# EAGLE design Energy Monitor (EAGLE 7.1.0)
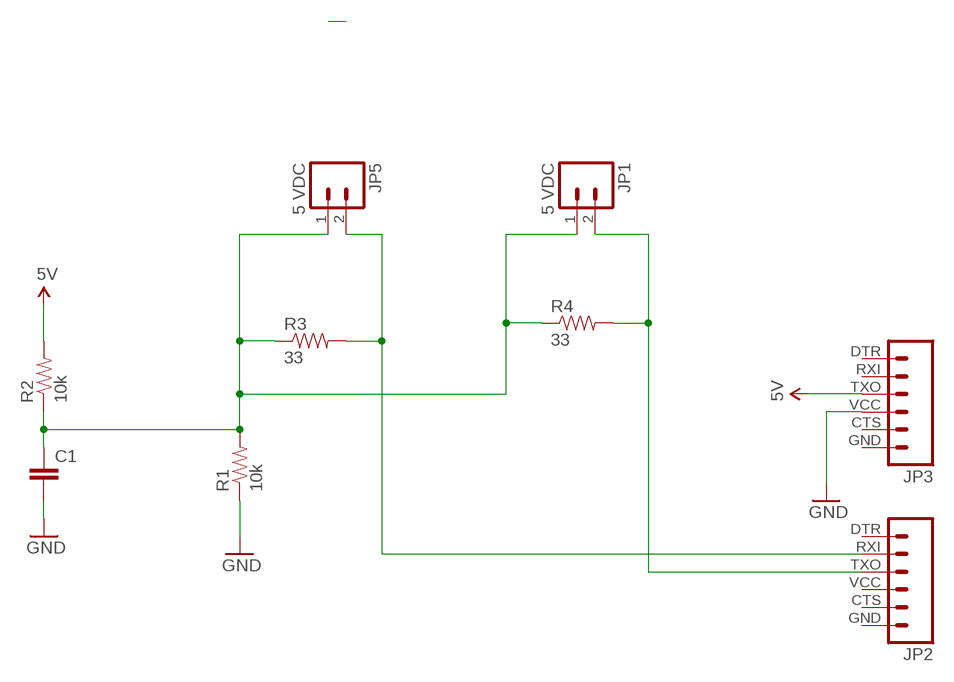
[diagram p0: schematic, sheet 1]

## Parts
C1  CAPPTH2  [CAP-PTH-SMALL2]
JP1  5 VDC  M025MM  [SCREWTERMINAL-5MM-2]
JP2  M06SIP  [1X06]
JP3  M06SIP  [1X06]
JP5  5 VDC  M025MM  [SCREWTERMINAL-5MM-2]
R1  10k  RESISTORAXIAL-0.3  [AXIAL-0.3]
R2  10k  RESISTORAXIAL-0.3  [AXIAL-0.3]
R3  33  RESISTORAXIAL-0.3  [AXIAL-0.3]
R4  33  RESISTORAXIAL-0.3  [AXIAL-0.3]

## Nets
5V: JP3.TXO R2.P$2
GND: C1.2 JP3.VCC R1.P$1
N$1: C1.1 JP1.1 JP5.1 R1.P$2 R2.P$1 R3.P$1 R4.P$1
N$3: JP1.2 JP2.TXO R4.P$2
N$5: JP2.RXI JP5.2 R3.P$2
Unconnected: JP2.CTS JP2.DTR JP2.GND JP2.VCC JP3.CTS JP3.DTR JP3.GND JP3.RXI

## Library data of the parts
C1 = SparkFun-Capacitors:CAP: Capacitor Standard 0603 ceramic capacitor, and 0.1" leaded capacitor.
JP1 JP5 = SparkFun-Connectors:M02: Standard 2-pin 0.1" header. Use with - straight break away headers ( PRT-00116) - right angle break away headers (PRT-00553) - swiss pins (PRT-00743) - machine pins (PRT-00117) - female headers (PRT-00115) Molex polarized connector foot print use with: PRT-08233 with associated crimp pins and housings. 2.54_SCREWTERM for use with PRT-10571. 3.5mm Screw Terminal footprints for PRT-08084 5mm Screw Terminal footprints for use with PRT-08432; STOREFRONT_ID: PRT-08432
JP2 JP3 = SparkFun-Connectors:M06: Header 6 Standard 6-pin 0.1" header. Use with straight break away headers (SKU : PRT-00116), right angle break away headers (PRT-00553), swiss pins (PRT-00743), machine pins (PRT-00117), and female headers (PRT-00115). Molex polarized connector foot print use with SKU : PRT-08094 with associated crimp pins and housings. NOTES ON THE VARIANTS LOCK and LOCK_LONGPADS... This footprint was designed to help hold the alignment of a through-hole component (i.e. 6-pin header) while soldering it into place. You may notice that each hole has been shifted either up or down by 0.005 of an inch from it's more standard position (which is a perfectly straight line). This slight alteration caused the pins (the squares in the middle) to touch the edges of the holes. Because they are alternating, it causes a "brace" to hold the component in place. 0.005 has proven to be the perfect amount of "off-center" position when using our standard breakaway headers. Although looks a little odd when you look at the bare footprint, once you have a header in there, the alteration is very hard to notice. Also,if you push a header all the way into place, it is covered up entirely on the bottom side. This idea of altering the position of holes to aid alignment will be further integrated into the Sparkfun Library for other footprints. It can help hold any component with 3 or more connection pins.
R1-R4 = SparkFun-Resistors:RESISTOR: Resistor Basic schematic elements and footprints for 0603, 1206, and PTH resistors.

## Board
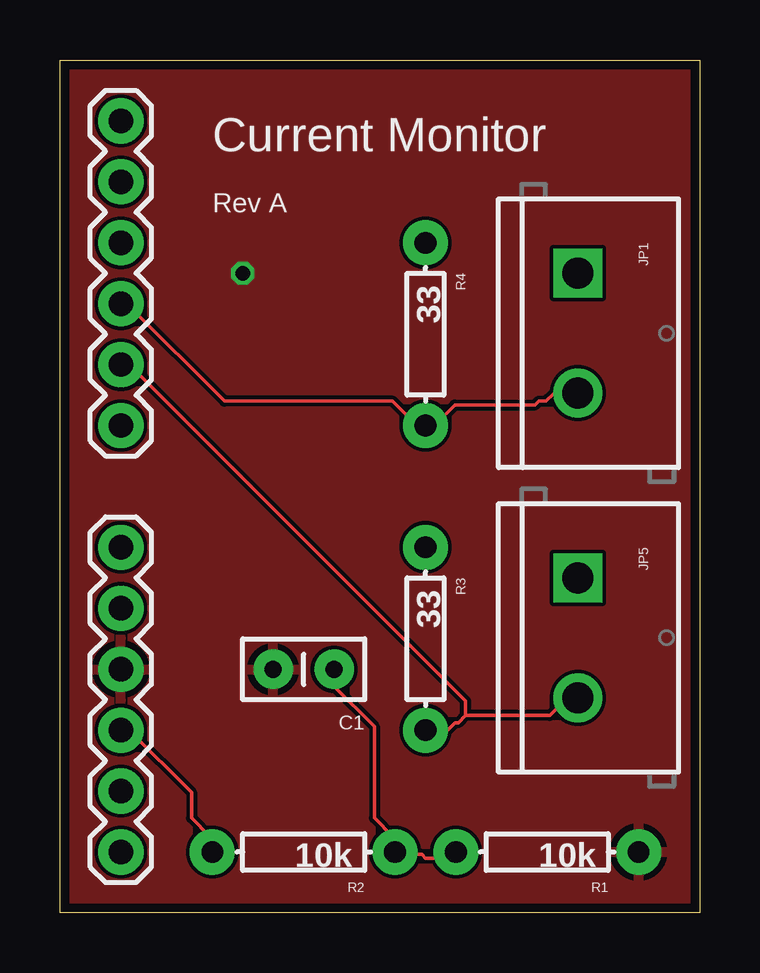
[diagram p1: board, top side]
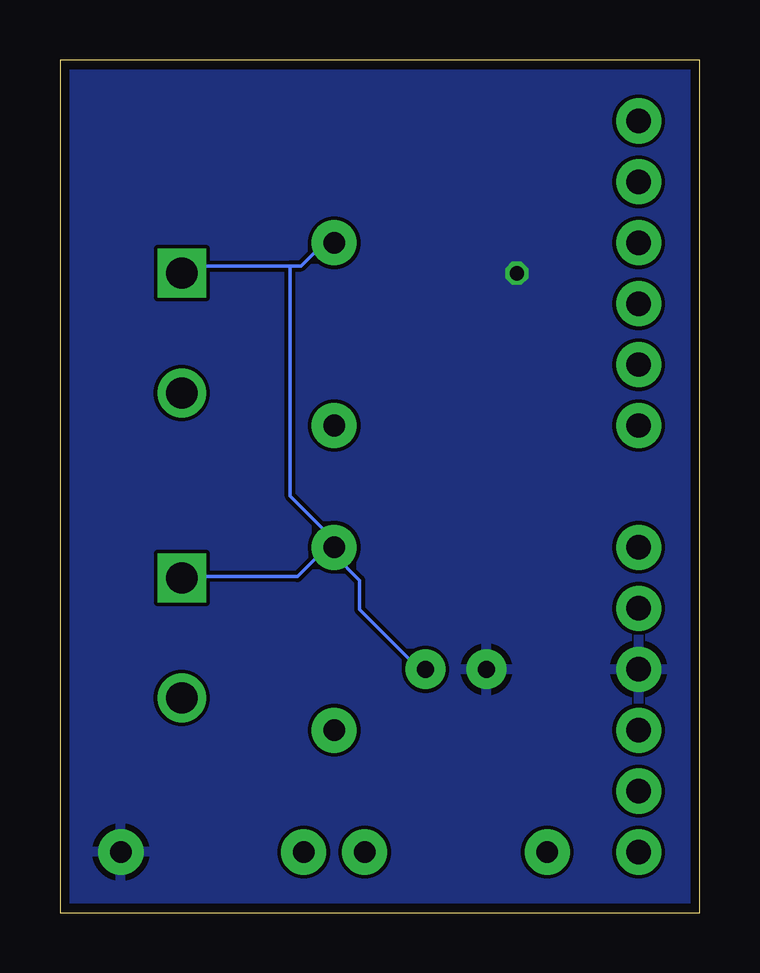
[diagram p2: board, bottom side, seen from below]

Size 26.67 x 35.56 mm. Coordinates in mm from the lower left corner, seen from the top.
Outline: 0,0 0,35.56 26.67,35.56 26.67,0 0,0
Copper layers (1*16): Top 0.0356mm / dielectric 1.5011mm / Bottom 0.0356mm
Design rules "LaenPCBOrder": minimum track width 6mil, minimum drill 13mil, track to track 6mil, track to pad 6mil, pad to pad 6mil, via to via 6mil, smd to smd 6mil, copper to edge 15mil, drill to drill 6mil, minimum pad ring 7mil, minimum via ring 7mil, stop-mask expansion 3mil, vias tented up to drill 0mil, thermal gap 10mil

### Footprints (pad centres in the part's own frame; a part is rotated, then mirrored left to right if it is on the bottom)
CAP-PTH-SMALL2 = drill 0.7 pad 1.651: 1 0,0; 2 2.54,0
SCREWTERMINAL-5MM-2 = drill 1.3 pad 2.032 square: 1 0,0 | drill 1.3 pad 2.032: 2 5,0
1X06 = drill 1.016 pad 1.88: CTS 10.16,0; DTR 0,0; GND 12.7,0; RXI 2.54,0; TXO 5.08,0; VCC 7.62,0
AXIAL-0.3 = drill 0.9 pad 1.88: P$1 -3.81,0; P$2 3.81,0

### Placement (x,y rotation side)
C1  11.43,10.16 180 top
JP1  21.59,26.67 270 top
JP2  2.54,20.32 90 top
JP3  2.54,2.54 90 top
JP5  21.59,13.97 270 top
R1  20.32,2.54 180 top
R2  10.16,2.54 180 top
R3  15.24,11.43 270 top
R4  15.24,24.13 270 top

### Tracks (layer width: path | path; a pad name or v marks a point on that pad's centre or on a via)
5V
  Top 0.152: JP3.TXO 2.9,7.62 5.49,5.03 5.49,3.96 6.25,3.2 6.25,2.59 R2.P$2
GND  (via drill 0.6)
  other vias: 7.62,26.67
  pour Bottom: -1.27,36.83 27.94,36.83 27.94,-1.27 -1.27,-1.27
  pour Top: -1.27,36.83 27.94,36.83 27.94,-1.27 -1.27,-1.27
N$1
  Top 0.152: R1.P$2 16.46,2.44 16.31,2.29 15.24,2.29 15.09,2.44 14.02,2.44 R2.P$1 13.87,2.59 13.87,3.2 13.11,3.96 13.11,7.77 11.43,9.45 C1.1
  Bottom 0.152: 17.07,26.98 21.18,26.98 21.49,26.67 JP1.1 | 17.07,26.98 16.61,26.98 15.7,27.89 15.24,27.89 R4.P$1 | 15.24,14.94 14.17,13.87 14.17,12.65 11.73,10.21 11.43,10.21 C1.1 | 15.24,14.94 15.85,14.94 16.76,14.02 21.49,14.02 JP5.1 | 15.24,14.94 R3.P$1 15.24,15.54 17.07,17.37 17.07,26.98
N$3
  Top 0.152: 15.24,20.42 14.78,20.42 13.87,21.34 6.86,21.34 2.9,25.3 2.59,25.3 JP2.TXO | 15.24,20.42 15.7,20.42 16.46,21.18 19.81,21.18 19.96,21.34 20.27,21.34 20.57,21.64 21.49,21.64 JP1.2 | 15.24,20.42 R4.P$2
N$5
  Top 0.152: R3.P$2 16.15,7.62 16.46,7.92 16.61,7.92 16.92,8.23 | 16.92,8.23 20.42,8.23 21.03,8.84 21.49,8.84 JP5.2 | JP2.RXI 2.9,22.86 16.92,8.84 16.92,8.23

### Text on the board
tNames: Current Monitor | Rev A